# EAGLE schematic 4PDTrelay_w_diodes (EAGLE 9.2.1)
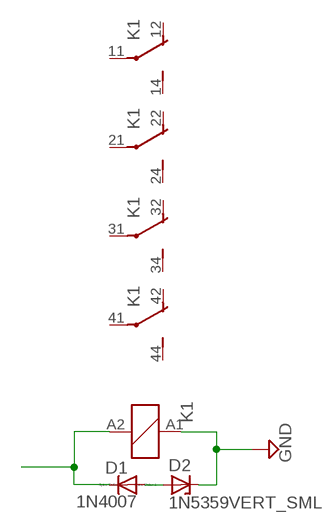
[diagram p0: schematic, sheet 1]

## Parts
D1  1N4007  [RAD2,5]
D2  1N5359VERT_SML  [RAD2.5_D2]
K1  PY14-02  [PY14-02]

## Nets
D$1: D1.A D2.A
GND: D2.C K1.A1
IN: D1.C K1.A2
Unconnected: K1.11(2:P) K1.12(2:O) K1.14(2:S) K1.21(3:P) K1.22(3:O) K1.24(3:S) K1.31(4:P) K1.32(4:O) K1.34(4:S) K1.41(5:P) K1.42(5:O) K1.44(5:S)

## Library data of the parts
D1 = relay_computer_custom:1N4007: DIODE general purpose rectifier, 1 A
D2 = relay_computer_custom:1N5359: Z DIODE 24 V, 5W
K1 = relay_computer_custom:PY14-02: Miniature Relay OMRON 12VDC 4PDT 3A Relay Relay: MY4DC12 https://octopart.com/my4dc12-omron-13160135 Socket: PY14-02 https://octopart.com/py14-02-omron-113738